# Altium schematic sheet Controller.SchDoc
size A4; SheetNumber: 2; SheetTotal: 5
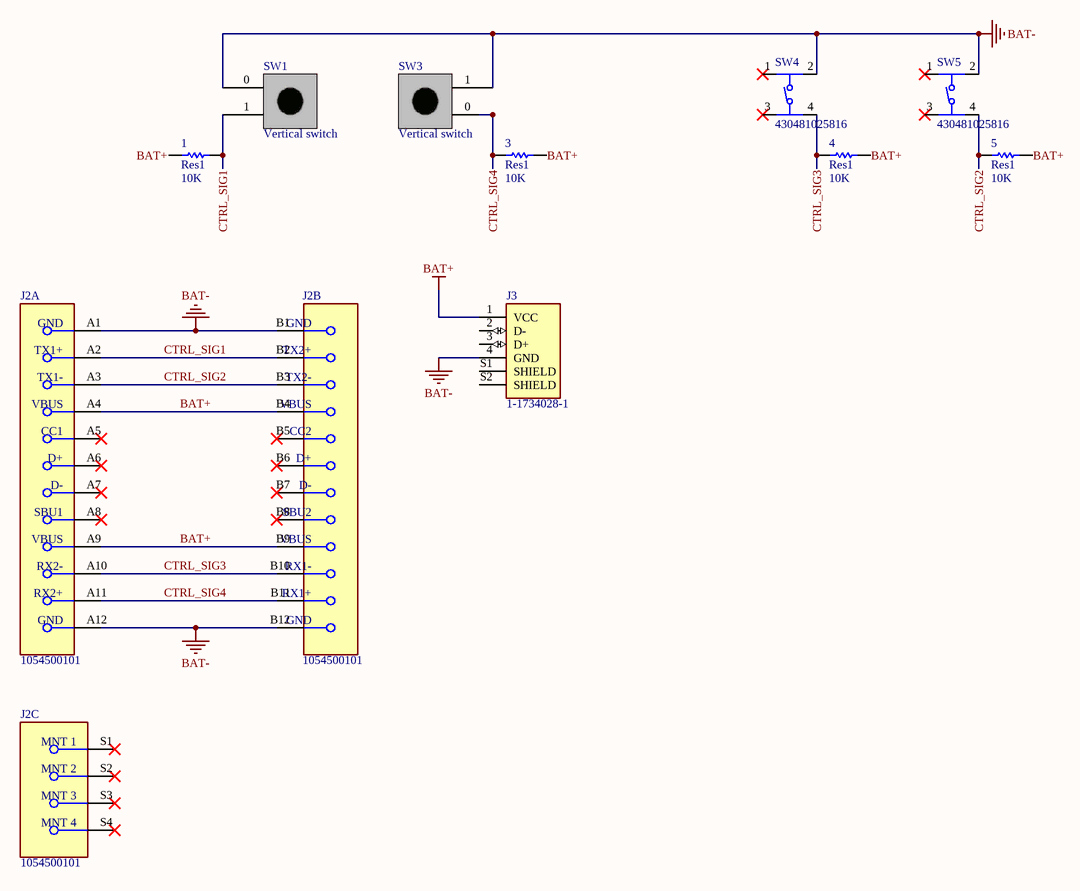
[diagram p0: Controller.SchDoc]

## Parts
1  Res1  value 10K  [6-0805_N]
3  Res1  value 10K  [6-0805_N]
4  Res1  value 10K  [6-0805_N]
5  Res1  value 10K  [6-0805_N]
J2  1054500101  [USB_C_Receptacle_Amphenol_12401548E4-2A]  (parts A,B,C of 3)
J3  1-1734028-1  [TE_1-1734028-1]
SW1  Vertical switch  [Btn_Vert]
SW3  Vertical switch  [Btn_Vert]
SW4  430481025816  [430481025816]
SW5  430481025816  [430481025816]

## Nets
BAT+: 1.2 3.1 4.1 5.1 J2.A4(VBUS) J2.A9(VBUS) J2.B4(VBUS) J2.B9(VBUS) J3.1(VCC)
BAT-: J2.A1(GND) J2.A12(GND) J2.B1(GND) J2.B12(GND) J3.4(GND) SW1.0 SW3.1 SW4.2 SW5.2
CTRL_SIG1: 1.1 J2.A2(TX1+) J2.B2(TX2+) SW1.1
CTRL_SIG2: 5.2 J2.A3(TX1-) J2.B3(TX2-) SW5.4
CTRL_SIG3: 4.2 J2.A10(RX2-) J2.B10(RX1-) SW4.4
CTRL_SIG4: 3.2 J2.A11(RX2+) J2.B11(RX1+) SW3.0

Not connected (* = marked no-connect by the designer): J2 A5(CC1)* A6(D+)* A7(D-)* A8(SBU1)* B5(CC2)* B6(D+)* B7(D-)* B8(SBU2)* S1(MNT_1)* S2(MNT_2)* S3(MNT_3)* S4(MNT_4)*; J3 2(D-) 3(D+) S1(SHIELD) S2(SHIELD); SW4 1* 3*; SW5 1* 3*

## Library data of the parts
1 3-5 = Res1: C269531; Published: 8-Jun-2000; LatestRevisionDate: 17-Jul-2002; LatestRevisionNote: Re-released for DXP Platform.; PackageReference: AXIAL-0.3; Publisher: Altium Limited; PackageDescription: Axial Device, Thru-Hole; 2 Leads; 0.3 in Pin Spacing
J2 = CMP-04767-000004-1: CONN RCP USB3.1 TYPEC 24P SMD RA; Manufacturer: Molex; Number Of Contacts: 24; Voltage Rating: 30V; Shielding: true; Is Female: yes; Current Rating: 0.25/1.25/5A; Pitch: 0.5mm; Conn Orientation: Right Angle; Package: 0; Height: 3.44mm; Footprint Url: https://www.molex.com/pdm_docs/sd/1054500101_sd.pdf; Device Class L1: Connectors; Category: Conn; Device Class L2: USB Connectors; Digikey Description: CONN RCP USB3.1 TYPEC 24P SMD RA; Contact Material: Gold,Nickel; Mouser Description: USB Shielded I/O Receptacle; Type C; Right Angle; Surface Mount; Gold over Nickel; ComponentLink2Description: Datasheet; Lead Free: Yes; Automotive: No; Temperature Range High: +85°C; RoHS: TRUE; Octopart: https://octopart.com/105450-0101-molex-68082325; ComponentLink2URL: https://www.molex.com/webdocs/datasheets/pdf/en-us/1054500101_IO_CONNECTORS.pdf; Temperature: -30°C to +85°C; Usb Standard: USB 3.1; Temperature Range Low: -30°C; Device Class L3: unset; Manufacturer Part Number: 1054500101
J3 = 1-1734028-1: Conn USB 2.0 Type A PL 4 POS Solder RA SMD 4 Terminal 1 Port T/R; MF: {'manufacturer': u'TE Connectivity'}; MP: 1-1734028-1; Package: None; Price: None; Value: *; Availability: Unavailable
SW1 SW3 = SWVERT: C294508
SW4 SW5 = 430481025816: <b>WS-TASV SMT Washable Tact Switch 6x6 mm  </B><BR><BR> <B>Material Properties</B> <BR> <BR>Cover Material : Stainless Steel <BR><BR> <B>Properties</B><BR> <BR>Actuator Material:LCP <BR>Actuator Flammability :UL94 V-0 <BR>Rating <BR>Actuator Color:Black; Salmon; White <BR>Contact Material:Stainless Steel <BR>Contact Plating:Silver <BR>Terminal Plating:Silver <BR>VR:12 V (DC) <BR>RISO:100 MÎ© <BR>Withstanding Voltage:250 V (AC) <BR>Washable:Yes <BR>Qty.:2000 <BR> <BR> <b>Mechanical Properties</b><BR> <BR>Stroke :0.25 mm<BR> <BR><b>General Information</b><br> <br>Operating Temperature:-40 up to +85 Â°C <BR>Washable:Yes <BR> <BR><b>Packaging Properties</b><br> <BR>Packaging:Tape and Reel  </b><br><BR>  <br><a href="https://www.we-online.com/catalog/media/o37542v209%20Family_WS-TASV_SMD_Tact_Switch_6x6mm_4304810xx8xx.jpg" title="Enlarge picture"> <img src="https://www.we-online.com/catalog/media/o37542v209%20Family_WS-TASV_SMD_Tact_Switch_6x6mm_4304810xx8xx.jpg"  width="320"></a><p>  Details see: <a href="https://www.we-online.com/catalog/en/TASV_6X6_SMD_WASHABLE/">https://www.we-online.com/catalog/en/TASV_6X6_SMD_WASHABLE/</a><p>  Updated by Ella Wu 2021-02-23 <br>2021(C) WÃ¼rth Elektronik; MF: {'manufacturer': u'Wurth Elektronik'}; MP: 430481025816; Price: None; Package: None; Availability: Unavailable; Value: *